# EAGLE schematic TS5A23167DCUR_breakout (EAGLE 8.5.1)
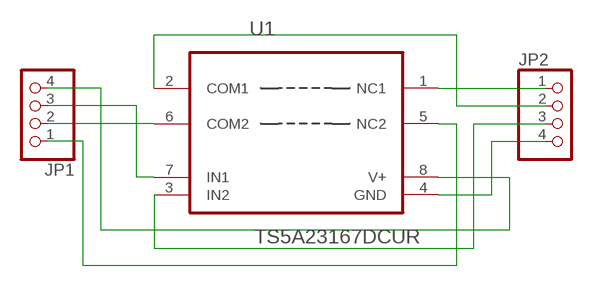
[diagram p0: schematic, sheet 1]

## Parts
JP1  PINHD-1X4  [1X04]
JP2  PINHD-1X4  [1X04]
U1  TS5A23167DCUR  [SOP50P310X90-8N]

## Nets
COM1: JP2.2 U1.2(COM1)
COM2: JP1.2 U1.6(COM2)
GND: JP2.4 U1.4(GND)
IN1: JP1.3 U1.7(IN1)
IN2: JP2.3 U1.3(IN2)
NO1: JP2.1 U1.1(NC1)
NO2: JP1.1 U1.5(NC2)
VCC: JP1.4 U1.8(V+)

## Library data of the parts
JP1 JP2 = pinhead:PINHD-1X4: PIN HEADER
U1 = TS5A2316XDCUR:TS5A23167DCUR: SPST ANALOG SWITCH; AVAILABILITY: Good; DESCRIPTION: 0.9-Ohm Dual SPST Analog Switch 5-V/3.3-V 2-Channel Analog Switch 8-VSSOP -40 to 85; MF: Texas Instruments; MP: TS5A23167DCUR; PACKAGE: VFSOP-8 Texas Instruments; PRICE: 0.46 USD